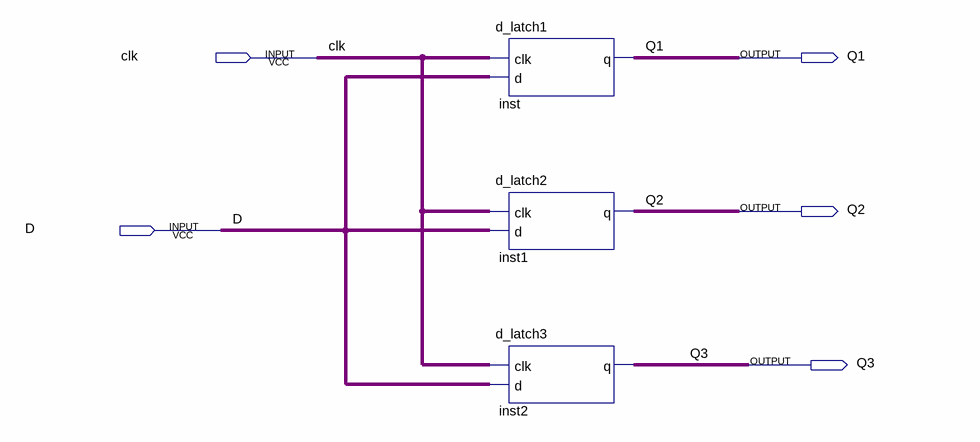
[diagram p0: schematic sheet]
// Quartus schematic LAB3_my.bdf as structural Verilog: 3 symbols, 5 pins
module LAB3_my (
  input  clk,
  input  D,
  output Q1,
  output Q2,
  output Q3
);

  d_latch1 inst (.clk(clk), .d(D), .q(Q1));
  d_latch2 inst1 (.clk(clk), .d(D), .q(Q2));
  d_latch3 inst2 (.clk(clk), .d(D), .q(Q3));
endmodule
